# Altium schematic sheet 4_waffling60-NMB_periferals.SchDoc: =ProjectTitle
size A4; Address1: github.com/4pplet/cyber60; Address2: Licence: CERN-OHL-S; SheetNumber: 5; SheetTotal: 5
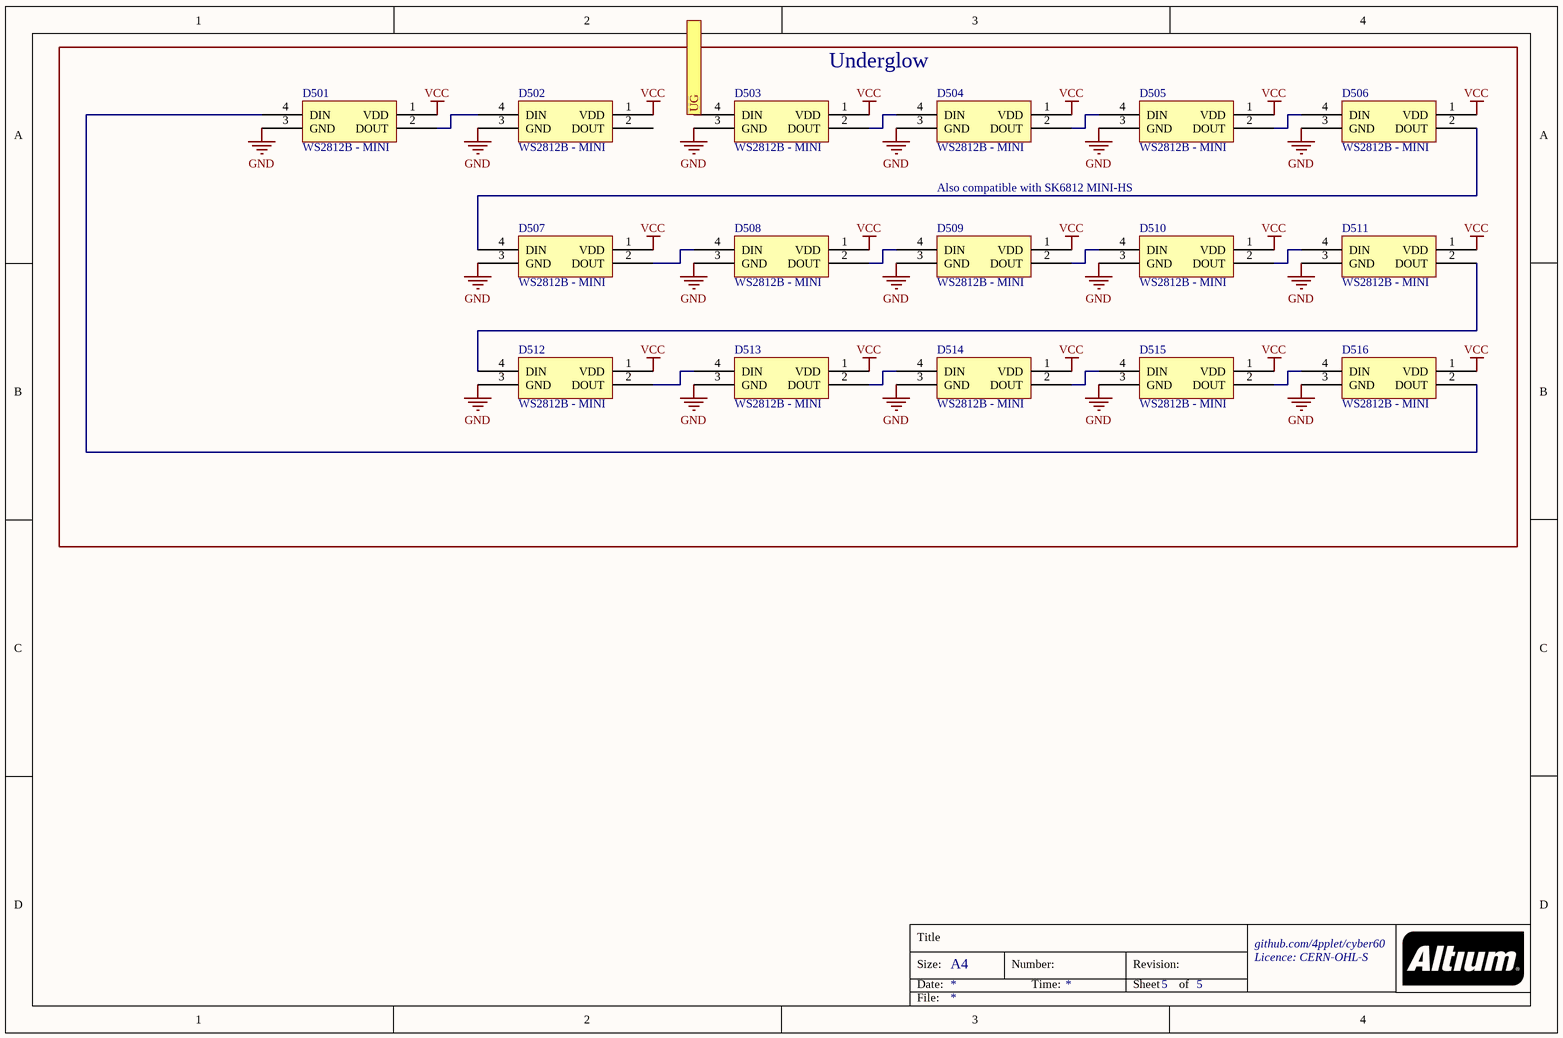
[diagram p0: 4_waffling60-NMB_periferals.SchDoc]

## Parts
D501  WS2812B - MINI  [WS2812B - 2020]
D502  WS2812B - MINI  [WS2812B - 2020]
D503  WS2812B - MINI  [WS2812B - 2020]
D504  WS2812B - MINI  [WS2812B - 2020]
D505  WS2812B - MINI  [WS2812B - 2020]
D506  WS2812B - MINI  [WS2812B - 2020]
D507  WS2812B - MINI  [WS2812B - 2020]
D508  WS2812B - MINI  [WS2812B - 2020]
D509  WS2812B - MINI  [WS2812B - 2020]
D510  WS2812B - MINI  [WS2812B - 2020]
D511  WS2812B - MINI  [WS2812B - 2020]
D512  WS2812B - MINI  [WS2812B - 2020]
D513  WS2812B - MINI  [WS2812B - 2020]
D514  WS2812B - MINI  [WS2812B - 2020]
D515  WS2812B - MINI  [WS2812B - 2020]
D516  WS2812B - MINI  [WS2812B - 2020]

## Ports
UG

## Nets
GND: D501.3(GND) D502.3(GND) D503.3(GND) D504.3(GND) D505.3(GND) D506.3(GND) D507.3(GND) D508.3(GND) D509.3(GND) D510.3(GND) D511.3(GND) D512.3(GND) D513.3(GND) D514.3(GND) D515.3(GND) D516.3(GND)
VCC: D501.1(VDD) D502.1(VDD) D503.1(VDD) D504.1(VDD) D505.1(VDD) D506.1(VDD) D507.1(VDD) D508.1(VDD) D509.1(VDD) D510.1(VDD) D511.1(VDD) D512.1(VDD) D513.1(VDD) D514.1(VDD) D515.1(VDD) D516.1(VDD)
UG: D503.4(DIN) ; port UG
NetD501_2: D501.2(DOUT) D502.4(DIN)
NetD501_4: D501.4(DIN) D516.2(DOUT)
NetD503_2: D503.2(DOUT) D504.4(DIN)
NetD504_2: D504.2(DOUT) D505.4(DIN)
NetD505_2: D505.2(DOUT) D506.4(DIN)
NetD506_2: D506.2(DOUT) D507.4(DIN)
NetD507_2: D507.2(DOUT) D508.4(DIN)
NetD508_2: D508.2(DOUT) D509.4(DIN)
NetD509_2: D509.2(DOUT) D510.4(DIN)
NetD510_2: D510.2(DOUT) D511.4(DIN)
NetD511_2: D511.2(DOUT) D512.4(DIN)
NetD512_2: D512.2(DOUT) D513.4(DIN)
NetD513_2: D513.2(DOUT) D514.4(DIN)
NetD514_2: D514.2(DOUT) D515.4(DIN)
NetD515_2: D515.2(DOUT) D516.4(DIN)

Not connected (* = marked no-connect by the designer): D502 2(DOUT)

## Notes on the sheet
- Underglow
- Also compatible with SK6812 MINI-HS
- Title
- Size:
- Date:
- A4
- Number:
- Time:
- Revision:
- Sheet
- of
- File:

## Library data of the parts
D501-D516 = WS2812B: MRF.Part: WS2812C-2020; LCSC MFG: Worldsemi; LCSC Part #: C965556